# EAGLE design version_1 (EAGLE 6.1)
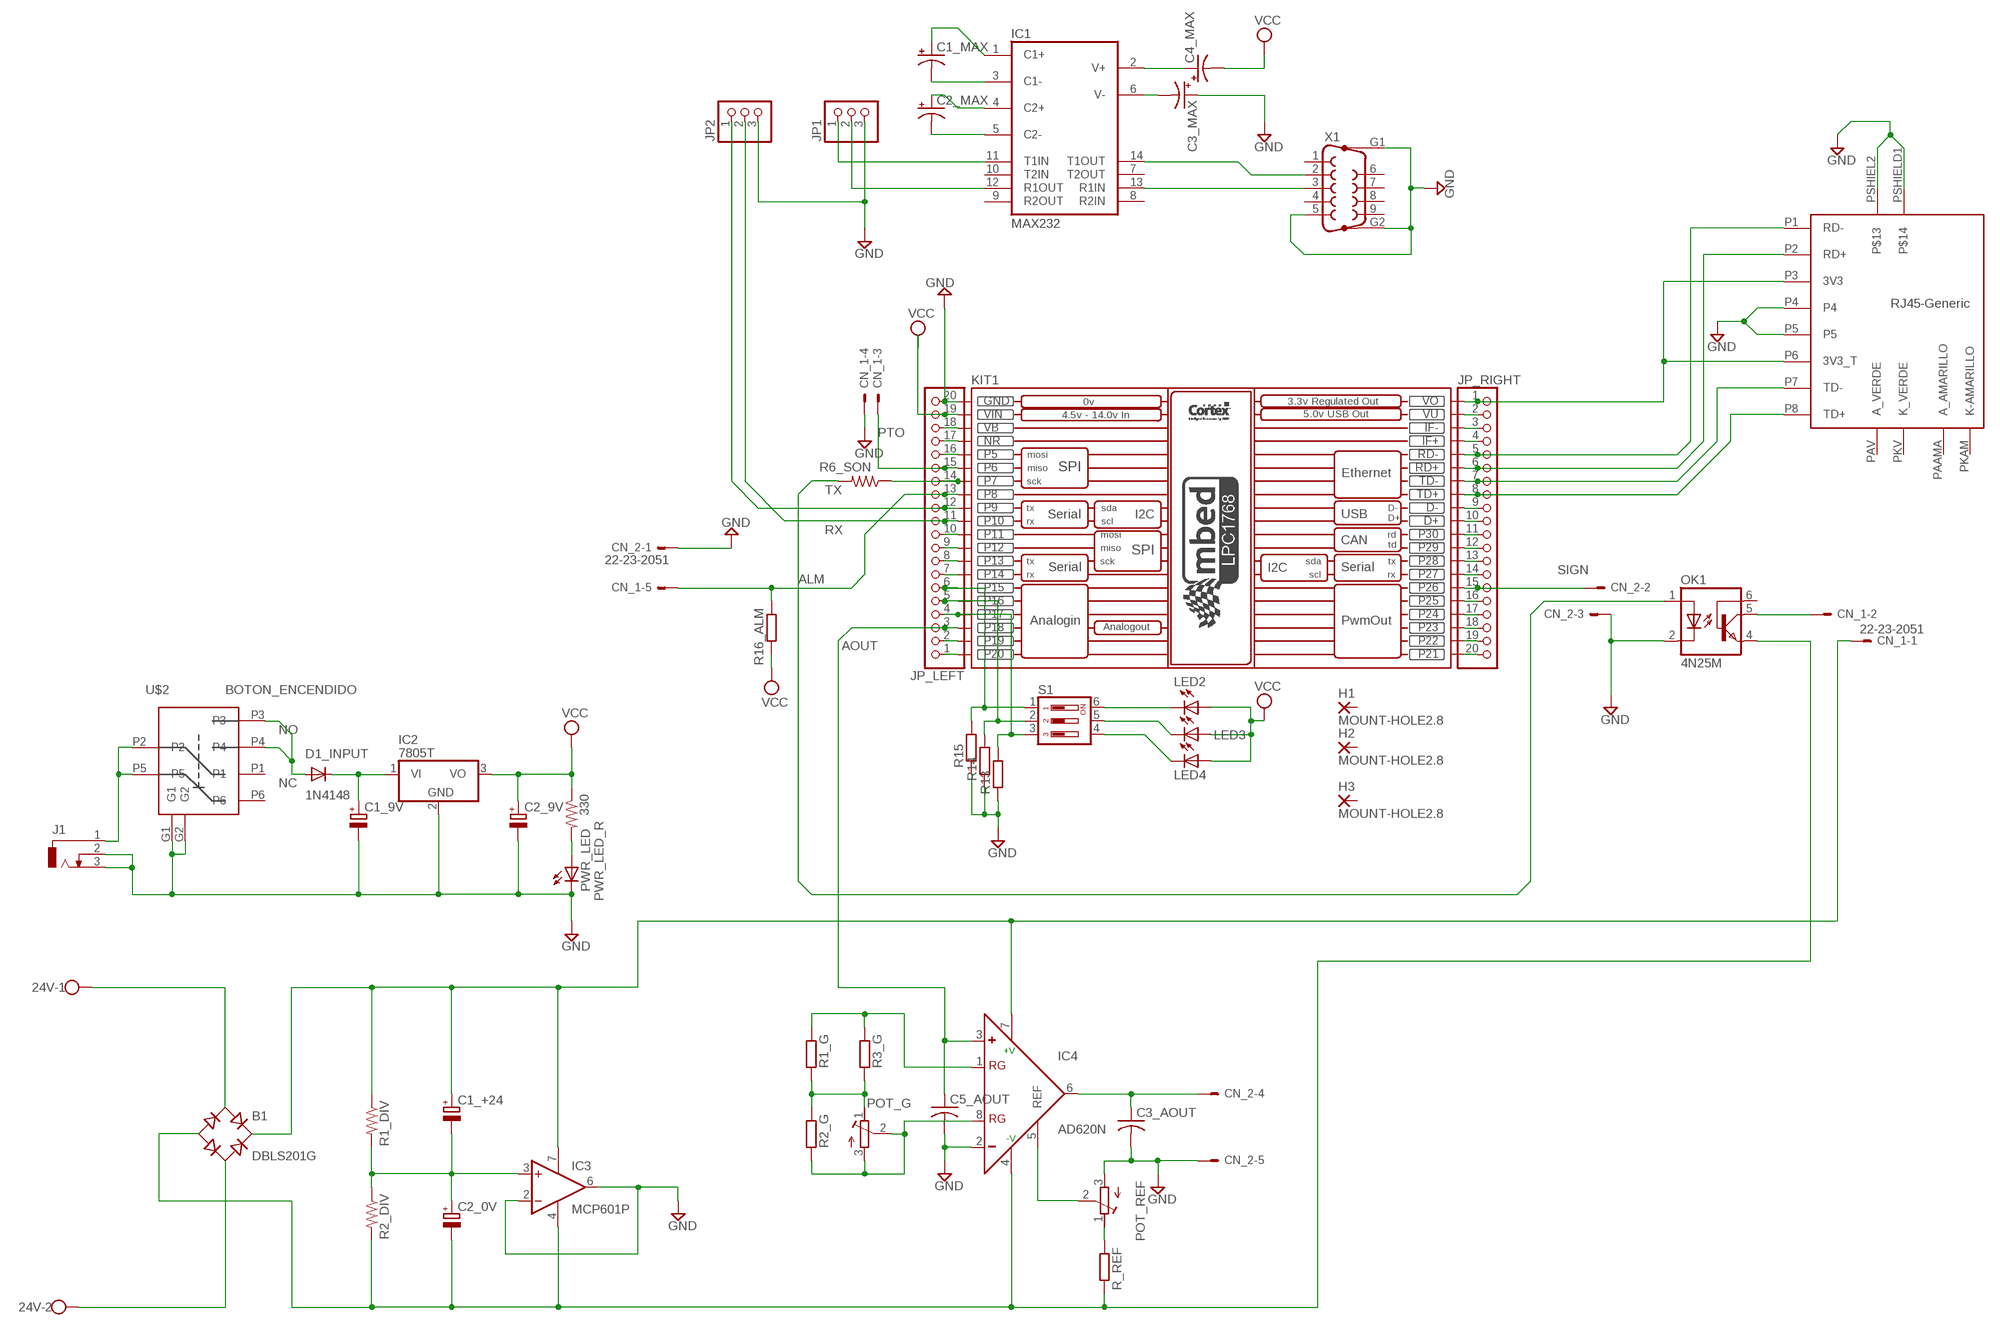
[diagram p0: schematic, sheet 1]

## Parts
24V  W237-02P  [W237-132]
B1  DBLS201G  [DBS]
C1_9V  CPOL-EUTT5D7  [TT5D7]
C1_+24  CPOL-EUTT5D7  [TT5D7]
C1_MAX  CPOL-USE2,5-6E  [E2,5-6E]
C2_0V  CPOL-EUTT5D7  [TT5D7]
C2_9V  CPOL-EUTT5D7  [TT5D7]
C2_MAX  CPOL-USE2,5-6E  [E2,5-6E]
C3_AOUT  C-US025-024X044  [C025-024X044]
C3_MAX  CPOL-USE2,5-6E  [E2,5-6E]
C4_MAX  CPOL-USE2,5-6E  [E2,5-6E]
C5_AOUT  C-US025-024X044  [C025-024X044]
CN_1  22-23-2051  [22-23-2051]
CN_2  22-23-2051  [22-23-2051]
D1_INPUT  1N4148  1N4148DO35-10  [DO35-10]
H1  MOUNT-HOLE2.8  2,54/0,8  [2,54/0,8]
H2  MOUNT-HOLE2.8  2,54/0,8  [2,54/0,8]
H3  MOUNT-HOLE2.8  2,54/0,8  [2,54/0,8]
IC1  MAX232  [DIL16]
IC2  7805T  [TO220H]
IC3  MCP601P  [DIL08]
IC4  AD620N  [DIL08]
J1  DCJ0303  [DCJ0303]
JP1  PINHD-1X3  [1X03]
JP2  PINHD-1X3  [1X03]
JP_LEFT  PINHD-1X20  [1X20]
JP_RIGHT  PINHD-1X20  [1X20]
KIT1  MBED_NXP_LPC1768  [MBED-KIT]
LED2  LED3MM  [LED3MM]
LED3  LED3MM  [LED3MM]
LED4  LED3MM  [LED3MM]
OK1  4N25M  [DIL06]
POT_G  R-TRIMMT93XB  [RTRIMT93XB]
POT_REF  R-TRIMMT93XB  [RTRIMT93XB]
PWR_LED  LED3MM  [LED3MM]
PWR_LED_R  330  R-US_0207/15  [0207/15]
R1_DIV  R-US_0207/10  [0207/10]
R1_G  R-EU_0207/2V  [0207/2V]
R2_DIV  R-US_0207/10  [0207/10]
R2_G  R-EU_0207/2V  [0207/2V]
R3_G  R-EU_0207/2V  [0207/2V]
R6_SON  R-US_0207/7  [0207/7]
R13  R-EU_0207/15  [0207/15]
R14  R-EU_0207/15  [0207/15]
R15  R-EU_0207/15  [0207/15]
R16_ALM  R-EU_0207/12  [0207/12]
R_REF  R-EU_0207/2V  [0207/2V]
S1  DIP03YL  [DIP03YL]
U$1  RJ-45-GENERIC  [RJ45-GENERIC]
U$2  BOTON_ENCENDIDO  [BOTON_ENCNEDIDO]
X1  F09HP  [F09HP]

## Nets
ALM: CN_1.5 JP_LEFT.13 KIT1.P$8(P8) R16_ALM.1
AOUT: C5_AOUT.1 IC4.3(+) JP_LEFT.3 KIT1.P$18(P18)
GND: C1_9V.- C2_9V.- C3_AOUT.2 C3_MAX.+ C5_AOUT.2 CN_1.4 CN_2.1 CN_2.3 CN_2.5 IC2.2(GND) IC3.2(-IN) IC3.6(OUT) IC4.2(-) J1.2 J1.3 JP1.3 JP2.3 JP_LEFT.20 KIT1.GND OK1.2(C) POT_REF.3(E) PWR_LED.K(C) R13.1 R14.1 R15.1 U$1.P4 U$1.P5 U$1.PSHIEL2 U$1.PSHIELD1 U$2.G1 U$2.G2 X1.5 X1.G1 X1.G2
N$1: B1.+ C1_+24.+ CN_1.1 IC3.7(V+) IC4.7(+V) R1_DIV.1
N$2: B1.- C2_0V.- IC3.4(V-) IC4.4(-V) OK1.4(EMI) R2_DIV.2 R_REF.2
N$3: C1_+24.- C2_0V.+ IC3.3(+IN) R1_DIV.2 R2_DIV.1
N$4: CN_1.2 OK1.5(COL)
N$5: JP_RIGHT.2 KIT1.VU
N$6: C3_AOUT.1 CN_2.4 IC4.6(OUT)
N$7: JP_RIGHT.3 KIT1.IF-
N$8: POT_REF.1(A) R_REF.1
N$9: IC4.1(RG) R1_G.1 R3_G.1
N$10: POT_G.1(A) R1_G.2 R2_G.1 R3_G.2
N$11: IC4.8(RG) POT_G.2(S) POT_G.3(E) R2_G.2
N$12: D1_INPUT.A U$2.P3 U$2.P4
N$13: JP_LEFT.5 KIT1.P$16(P16) R14.2 S1.2
N$14: JP_RIGHT.4 KIT1.IF+
N$15: IC4.5(REF) POT_REF.2(S)
N$16: JP_RIGHT.11 KIT1.P$30(P30)
N$17: OK1.1(A) R6_SON.2
N$18: J1.1 U$2.P2 U$2.P5
N$19: JP_LEFT.4 KIT1.P$17(P17) R13.2 S1.3
N$20: JP_RIGHT.1 KIT1.VOUT(VO) U$1.P3(3V3) U$1.P6(3V3_T)
N$21: C1_9V.+ D1_INPUT.C IC2.1(VI)
N$22: IC1.11(T1IN) JP1.1
N$23: IC1.12(R1OUT) JP1.2
N$24: LED2.K(C) S1.6
N$25: LED3.K(C) S1.5
N$26: LED4.K(C) S1.4
N$27: JP_RIGHT.5 KIT1.RD- U$1.P1(RD-)
N$28: JP_RIGHT.6 KIT1.RD+ U$1.P2(RD+)
N$29: JP_RIGHT.7 KIT1.TD- U$1.P7(TD-)
N$30: JP_RIGHT.8 KIT1.TD+ U$1.P8(TD+)
N$31: JP_RIGHT.9 KIT1.D-
N$32: JP_RIGHT.10 KIT1.D+
N$33: C1_MAX.+ IC1.1(C1+)
N$34: C1_MAX.- IC1.3(C1-)
N$35: C2_MAX.- IC1.5(C2-)
N$36: C2_MAX.+ IC1.4(C2+)
N$37: C4_MAX.+ IC1.2(V+)
N$38: C3_MAX.- IC1.6(V-)
N$39: JP_RIGHT.13 KIT1.P$28(P28)
N$40: IC1.14(T1OUT) X1.2
N$41: IC1.13(R1IN) X1.3
N$42: JP_RIGHT.18 KIT1.P$23(P23)
N$43: JP_RIGHT.19 KIT1.P$22(P22)
N$44: JP_RIGHT.14 KIT1.P$27(P27)
N$45: JP_RIGHT.16 KIT1.P$25(P25)
N$47: JP_RIGHT.17 KIT1.P$24(P24)
N$48: JP_LEFT.18 KIT1.VB
N$49: JP_LEFT.17 KIT1.NR
N$50: JP_LEFT.16 KIT1.P$5(P5)
N$51: JP_LEFT.14 KIT1.P$7(P7) R6_SON.1
N$53: JP_LEFT.10 KIT1.P$11(P11)
N$54: JP_LEFT.9 KIT1.P$12(P12)
N$55: JP_LEFT.8 KIT1.P$13(P13)
N$56: JP_LEFT.6 KIT1.P$15(P15) R15.2 S1.1
N$57: JP_LEFT.7 KIT1.P$14(P14)
N$59: JP_LEFT.2 KIT1.P$19(P19)
N$60: JP_LEFT.1 KIT1.P$20(P20)
N$61: PWR_LED.A PWR_LED_R.2
N$62: JP_RIGHT.20 KIT1.P$21(P21)
N$64: 24V.1 B1.AC1
N$65: 24V.2 B1.AC2
PTO: CN_1.3 JP_LEFT.15 KIT1.P$6(P6)
RX: JP2.2 JP_LEFT.11 KIT1.P$10(P10)
SIGN: CN_2.2 JP_RIGHT.15 KIT1.P$26(P26)
SIGN+: JP_RIGHT.12 KIT1.P$29(P29)
TX: JP2.1 JP_LEFT.12 KIT1.P$9(P9)
VCC: C2_9V.+ C4_MAX.- IC2.3(VO) JP_LEFT.19 KIT1.VIN LED2.A LED3.A LED4.A PWR_LED_R.1 R16_ALM.2
Unconnected: H1.1(P) H2.1(P) H3.1(P) IC1.7(T2OUT) IC1.8(R2IN) IC1.9(R2OUT) IC1.10(T2IN) OK1.6(BAS) U$1.PAAMA(A_AMARILLO) U$1.PAV(A_VERDE) U$1.PKAM(K-AMARILLO) U$1.PKV(K_VERDE) U$2.P1 U$2.P6 X1.1 X1.4 X1.6 X1.7 X1.8 X1.9

## Power pins joined to a net without a drawn wire
GND: IC1.15(GND)
VCC: IC1.16(VCC)

## Library data of the parts
24V = con-wago-508:W237-02P: WAGO SREW CLAMP
B1 = rectifier:DB?*G: Single Phase 1.0 AMP Glass Passivated Bridge Rectifier Taiwan Semiconductor Co.,Ltd. - TSC Source: http://www.taiwansemi.com/TSCbig5/ezcatfiles/cust/img/img/db101g.pdf http://www.ts.com.tw/db/pictures/modules/PDT/PDT060207001/DBLS201G.pdf
C1_9V C1_+24 C2_0V C2_9V = rcl:CPOL-EU: POLARIZED CAPACITOR, European symbol
C1_MAX C2_MAX C3_MAX C4_MAX = rcl:CPOL-US: POLARIZED CAPACITOR, American symbol
C3_AOUT C5_AOUT = rcl:C-US: CAPACITOR, American symbol
CN_1 CN_2 = con-molex:22-23-2051: .100" (2.54mm) Center Header - 5 Pin
D1_INPUT = diode:1N4148: DIODE high speed (Philips)
H1-H3 = wirepad:2,54/0,8: THROUGH-HOLE PAD
IC1 = maxim:MAX232: RS232 TRANSEIVER
IC2 = linear:78*: Positive VOLTAGE REGULATOR Source: http://cache.national.com/ds/LM/LM78L05.pdf http://www.fairchildsemi.com/ds/LM/LM7805.pdf
IC3 = linear:MCP601: Single Op Amp 2.7V to 6.0V Single Supply CMOS Source: http://ww1.microchip.com/downloads/en/DeviceDoc/21314g.pdf
IC4 = analog-devices:AD620: Low Cost, Low Power, Instrumentation Amplifier Source: http://www.analog.com/UploadedFiles/Data_Sheets/37793330023930AD620_e.pdf
J1 = con-jack:DCJ0303: DC POWER JACK Source: DCJ0303.pdf
JP1 JP2 = pinhead:PINHD-1X3: PIN HEADER
JP_LEFT JP_RIGHT = pinhead:PINHD-1X20: PIN HEADER
KIT1 = MBED_v2.1:MBED_NXP_LPC1768: Mbed LPC1768 - ARM CORTEX v2.1 * Schematic symbol is now placed in eagles's default raster. *The pads diameter are suitable for routing between mbed pins * mbed pads are 0.8 mm drill diameter. --------------------------------------------- Created by: Mohamed Yousry *Alexandria, Egypt *Email: mohamed.yousry@ieeegoldegypt.org
LED2-LED4 PWR_LED = led:LED: LED OSRAM: - CHIPLED LG R971, LG N971, LY N971, LG Q971, LY Q971, LO R971, LY R971 LH N974, LH R974 LS Q976, LO Q976, LY Q976 LO Q996 - Hyper CHIPLED LW Q18S LB Q993, LB Q99A, LB R99A - SideLED LS A670, LO A670, LY A670, LG A670, LP A670 LB A673, LV A673, LT A673, LW A673 LH A674 LY A675 LS A676, LA A676, LO A676, LY A676, LW A676 LS A679, LY A679, LG A679 - Hyper Micro SIDELED® LS Y876, LA Y876, LO Y876, LY Y876 LT Y87S - SmartLED LW L88C, LW L88S LB L89C, LB L89S, LG L890 LS L89K, LO L89K, LY L89K LS L896, LA L896, LO L896, LY L896 - TOPLED LS T670, LO T670, LY T670, LG T670, LP T670 LSG T670, LSP T670, LSY T670, LOP T670, LYG T670 LG T671, LOG T671, LSG T671 LB T673, LV T673, LT T673, LW T673 LH T674 LS T676, LA T676, LO T676, LY T676, LB T676, LH T676, LSB T676, LW T676 LB T67C, LV T67C, LT T67C, LS T67K, LO T67K, LY T67K, LW E67C LS E67B, LA E67B, LO E67B, LY E67B, LB E67C, LV E67C, LT E67C LW T67C LS T679, LY T679, LG T679 LS T770, LO T770, LY T770, LG T770, LP T770 LB T773, LV T773, LT T773, LW T773 LH T774 LS E675, LA E675, LY E675, LS T675 LS T776, LA T776, LO T776, LY T776, LB T776 LHGB T686 LT T68C, LB T68C - Hyper Mini TOPLED® LB M676 - Mini TOPLED Santana® LG M470 LS M47K, LO M47K, LY M47K Source: http://www.osram.convergy.de LUXEON: - LUMILED® LXK2-PW12-R00, LXK2-PW12-S00, LXK2-PW14-U00, LXK2-PW14-V00 LXK2-PM12-R00, LXK2-PM12-S00, LXK2-PM14-U00 LXK2-PE12-Q00, LXK2-PE12-R00, LXK2-PE12-S00, LXK2-PE14-T00, LXK2-PE14-U00 LXK2-PB12-K00, LXK2-PB12-L00, LXK2-PB12-M00, LXK2-PB14-N00, LXK2-PB14-P00, LXK2-PB14-Q00 LXK2-PR12-L00, LXK2-PR12-M00, LXK2-PR14-Q00, LXK2-PR14-R00 LXK2-PD12-Q00, LXK2-PD12-R00, LXK2-PD12-S00 LXK2-PH12-R00, LXK2-PH12-S00 LXK2-PL12-P00, LXK2-PL12-Q00, LXK2-PL12-R00 Source: www.luxeon.com KINGBRIGHT: KA-3528ASYC Source: www.kingbright.com
OK1 = optocoupler:4N*?M: General Purpose 6-Pin Phototransistor Optocouplers Source: http://www.fairchildsemi.com/ds/4N/4N35-M.pdf
POT_G POT_REF = rcl:R-TRIMM: Trimm resistor
PWR_LED_R R6_SON = rcl:R-US_: RESISTOR, American symbol
R1_DIV R2_DIV = resistor:R-US_: RESISTOR, American symbol
R1_G R2_G R3_G R13-R15 R16_ALM R_REF = rcl:R-EU_: RESISTOR, European symbol
S1 = switch-dil:DIP03YL: DIL/CODE SWITCH
U$1 = RJ45:RJ-45-GENERIC
U$2 = Boton_Encendido:BOTON_ENCENDIDO
X1 = con-subd:F09HP: SUB-D

## Board
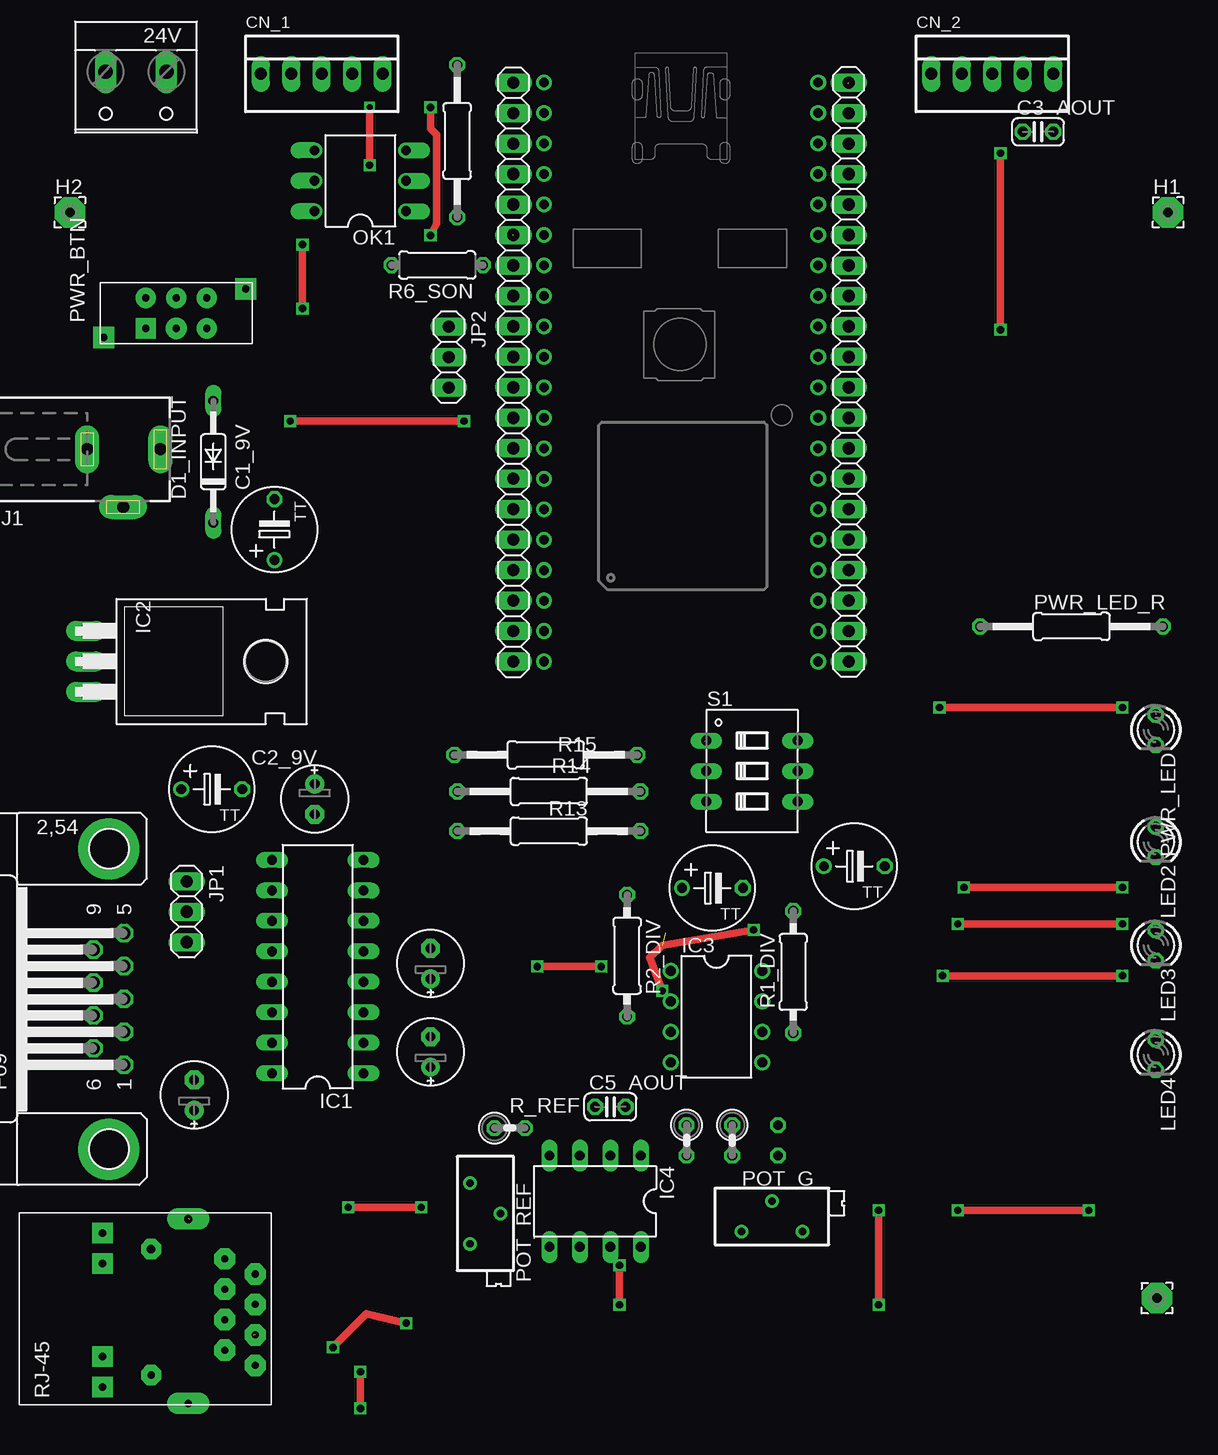
[diagram p1: board, top side]
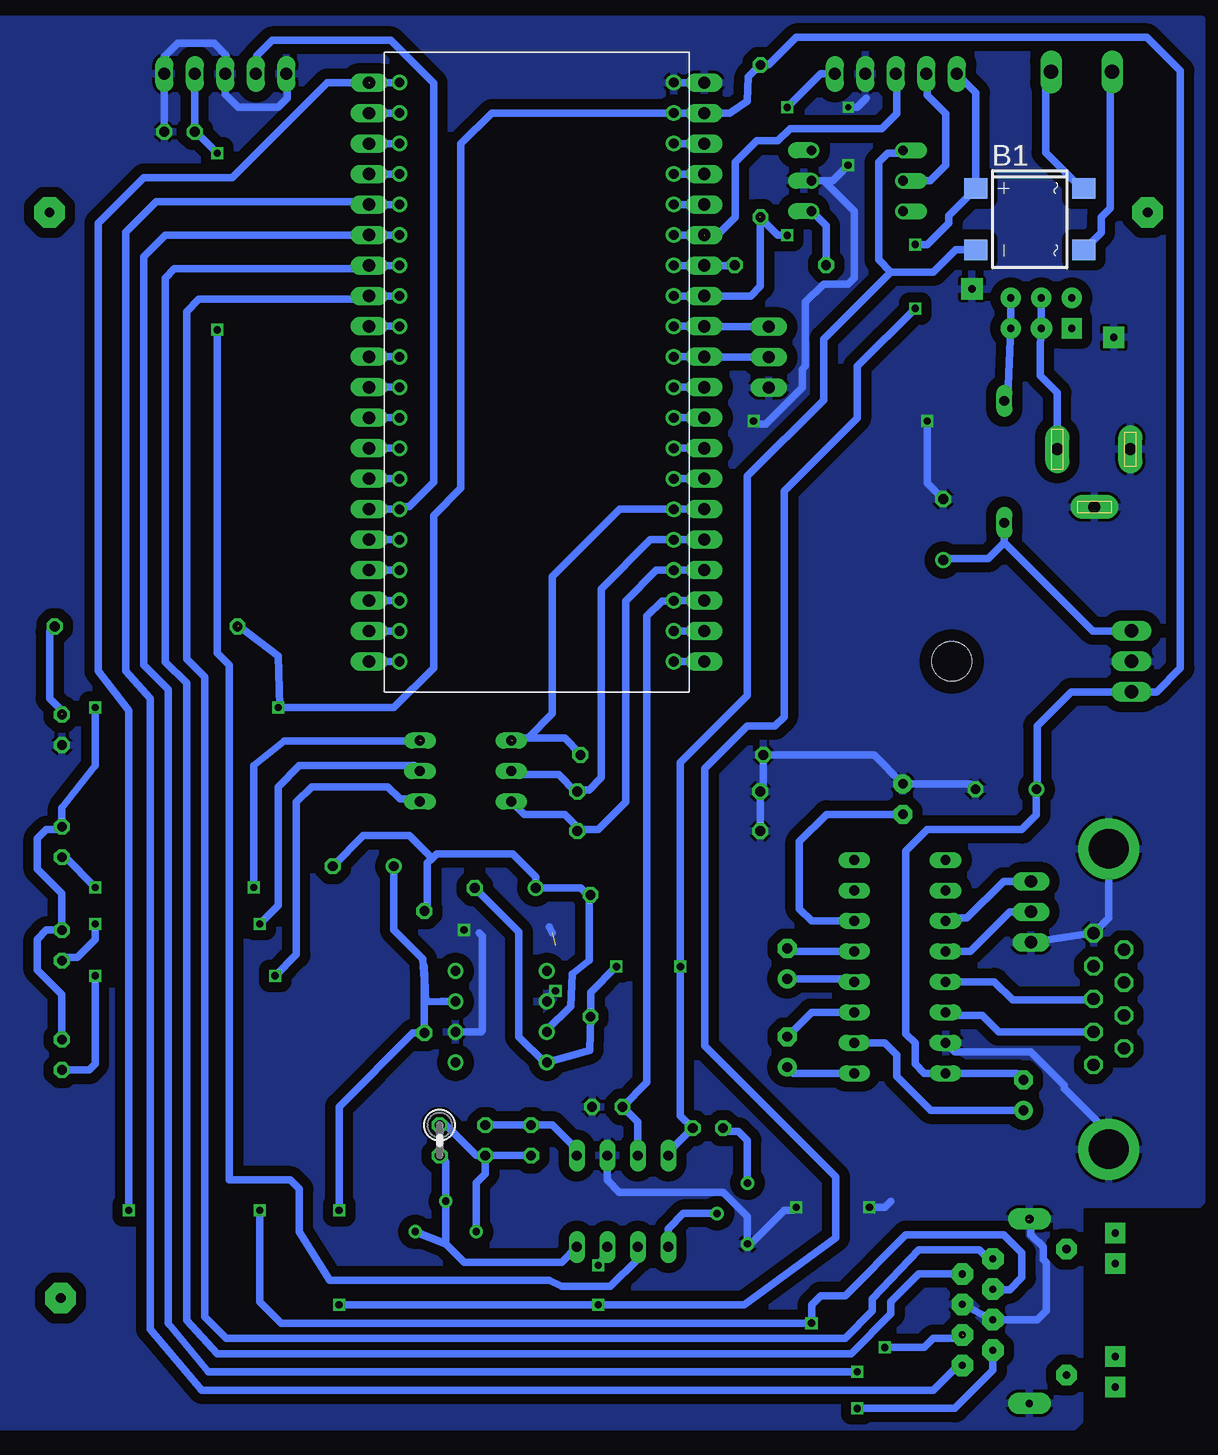
[diagram p2: board, bottom side, seen from below]

No outline drawn. Coordinates in mm, seen from the top.
Copper layers (1*16): Top 0.035mm / dielectric 1.5mm / Bottom 0.035mm
Design rules: minimum track width 10mil, minimum drill 24mil, track to track 34mil, track to pad 34mil, pad to pad 34mil, via to via 34mil, smd to smd 34mil, copper to edge 40mil, drill to drill 8mil, minimum pad ring 10mil, minimum via ring 8mil, stop-mask expansion 4mil, vias tented up to drill 0mil, thermal gap 10mil

### Footprints (pad centres in the part's own frame; a part is rotated, then mirrored left to right if it is on the bottom)
W237-132 = drill 1.194 long: 1 -2.54,-0.635; 2 2.54,-0.635
DBS = smd 1.7 x 1.9: + -2.55,-4.5; - 2.55,-4.5; AC1 -2.55,4.5; AC2 2.55,4.5
TT5D7 = drill 0.813: + -2.54,0 | drill 0.813 octagon: - 2.54,0
E2,5-6E = drill 0.813 pad 1.575: + -1.27,0 | drill 0.813 pad 1.575 octagon: - 1.27,0
C025-024X044 = drill 0.813 octagon: 1 -1.27,0; 2 1.27,0
22-23-2051 = drill 1 long: 1 -5.08,0; 2 -2.54,0; 3 0,0; 4 2.54,0; 5 5.08,0
DO35-10 = drill 0.813 long: A 5.08,0; C -5.08,0
2,54/0,8 = drill 0.813 pad 2.54 octagon: 1 0,0
DIL16 = drill 0.813 long: 1 -8.89,-3.81; 2 -6.35,-3.81; 3 -3.81,-3.81; 4 -1.27,-3.81; 5 1.27,-3.81; 6 3.81,-3.81; 7 6.35,-3.81; 8 8.89,-3.81; 9 8.89,3.81; 10 6.35,3.81; 11 3.81,3.81; 12 1.27,3.81; 13 -1.27,3.81; 14 -3.81,3.81; 15 -6.35,3.81; 16 -8.89,3.81
TO220H = drill 1.118 long: 1 -2.54,-10.16; 2 0,-10.16; 3 2.54,-10.16 | hole 3.302: 0,4.826
DIL08 = drill 0.813 pad 1.27: 1 -3.81,-3.81; 2 -1.27,-3.81; 3 1.27,-3.81; 4 3.81,-3.81; 5 3.81,3.81; 6 1.27,3.81; 7 -1.27,3.81; 8 -3.81,3.81
DIL08' = drill 0.813 long: 1 -3.81,-3.81; 2 -1.27,-3.81; 3 1.27,-3.81; 4 3.81,-3.81; 5 3.81,3.81; 6 1.27,3.81; 7 -1.27,3.81; 8 -3.81,3.81
DCJ0303 = drill 1 pad 2 long: 1 0,3.1; 2 4.8,0; 3 0,-3
1X03 = drill 1.016 long: 1 -2.54,0; 2 0,0; 3 2.54,0
1X20 = drill 1.016 long: 1 -24.13,0; 2 -21.59,0; 3 -19.05,0; 4 -16.51,0; 5 -13.97,0; 6 -11.43,0; 7 -8.89,0; 8 -6.35,0; 9 -3.81,0; 10 -1.27,0; 11 1.27,0; 12 3.81,0; 13 6.35,0; 14 8.89,0; 15 11.43,0; 16 13.97,0; 17 16.51,0; 18 19.05,0; 19 21.59,0; 20 24.13,0
MBED-KIT = drill 0.8: D+ 11.43,1.27; D- 11.43,3.81; GND -11.43,24.13; IF+ 11.43,16.51; IF- 11.43,19.05; NR -11.43,16.51; P$5 -11.43,13.97; P$6 -11.43,11.43; P$7 -11.43,8.89; P$8 -11.43,6.35; P$9 -11.43,3.81; P$10 -11.43,1.27; P$11 -11.43,-1.27; P$12 -11.43,-3.81; P$13 -11.43,-6.35; P$14 -11.43,-8.89; P$15 -11.43,-11.43; P$16 -11.43,-13.97; P$17 -11.43,-16.51; P$18 -11.43,-19.05; P$19 -11.43,-21.59; P$20 -11.43,-24.13; P$21 11.43,-24.13; P$22 11.43,-21.59; P$23 11.43,-19.05; P$24 11.43,-16.51; P$25 11.43,-13.97; P$26 11.43,-11.43; P$27 11.43,-8.89; P$28 11.43,-6.35; P$29 11.43,-3.81; P$30 11.43,-1.27; RD+ 11.43,11.43; RD- 11.43,13.97; TD+ 11.43,6.35; TD- 11.43,8.89; VB -11.43,19.05; VIN -11.43,21.59; VOUT 11.43,24.13; VU 11.43,21.59
LED3MM = drill 0.813 octagon: A -1.27,0; K 1.27,0
DIL06 = drill 0.813 offset: 1 -2.54,-3.81; 2 0,-3.81; 3 2.54,-3.81; 4 2.54,3.81; 5 0,3.81; 6 -2.54,3.81
RTRIMT93XB = drill 0.61: 1 1.27,-2.54; 2 -1.27,0; 3 1.27,2.54
0207/15 = drill 0.813 octagon: 1 -7.62,0; 2 7.62,0
0207/10 = drill 0.813 octagon: 1 -5.08,0; 2 5.08,0
0207/2V = drill 0.813 octagon: 1 -1.27,0; 2 1.27,0
0207/7 = drill 0.813 octagon: 1 -3.81,0; 2 3.81,0
0207/12 = drill 0.813 octagon: 1 -6.35,0; 2 6.35,0
DIP03YL = drill 0.813 long: 1 -2.54,-3.81; 2 0,-3.81; 3 2.54,-3.81; 4 2.54,3.81; 5 0,3.81; 6 -2.54,3.81
RJ45-GENERIC = drill 0.6 pad 1.778 octagon: P1 12.2,19.685; P2 10.93,17.145; P3 9.66,19.685; P4 8.39,17.145; P5 7.12,19.685; P6 5.85,17.145; P7 4.58,19.685; P8 3.31,17.145 | drill 0.6 pad 1.676 square: PAAMA 1.17,6.958; PAV 11.465,6.958; PKAM 3.71,6.958; PKV 14.005,6.958 | drill 0.6 pad 1.778 long: PSHIEL2 15.375,14.105 | drill 0.7 pad 1.778 long: PSHIELD1 0,14.105 | drill 0.7 pad 1.676 octagon: PSTAND 2.5,11.008 | drill 0.6 pad 1.676 octagon: PSTAND2 13,11.008
BOTON_ENCNEDIDO = drill 0.6 pad 1.778 square: G1 -2.019,6.039; G2 2.018,-5.785 | drill 0.6 pad 1.676 square: P1 -1.27,2.54 | drill 0.6 pad 1.778: P2 -1.27,0 | drill 0.6 pad 1.676: P3 -1.27,-2.54; P4 1.27,-2.54; P5 1.27,0; P6 1.27,2.54
F09HP = drill 1.016 octagon: 1 -5.486,-1.27; 2 -2.743,-1.27; 3 0,-1.27; 4 2.743,-1.27; 5 5.486,-1.27; 6 -4.115,1.27; 7 -1.372,1.27; 8 1.372,1.27; 9 4.115,1.27 | drill 3.302 pad 5.08: G1 -12.522,0; G2 12.522,0

### Placement (x,y rotation side)
24V  10,115.11 180 top
B1  14.32,103.46 270 bottom
C1_9V  21.54,77.58 90 top
C1_+24  69.87,49.51 0 top
C1_MAX  34.54,34.04 90 top
C2_0V  58.04,47.7 0 top
C2_9V  16.31,55.94 0 top
C2_MAX  34.54,41.4 90 top
C3_AOUT  85.17,110.74 0 top
C3_MAX  24.89,55.12 270 top
C4_MAX  14.84,30.44 90 top
C5_AOUT  49.53,29.46 0 top
CN_1  25.48,115.57 0 top
CN_2  81.36,115.57 0 top
D1_INPUT  16.45,83.23 90 top
H1  96.01,104.02 0 top
H2  4.5,104.02 0 top
H3  95.08,13.51 0 top
IC1  25.15,41.15 90 top
IC2  15.99,66.6 270 top
IC3  58.37,36.97 270 top
IC4  AD620N  [DIL08']  48.26,21.59 180 top
J1  8.93,84.27 270 top
JP1  14.22,45.72 270 top
JP2  36.07,91.95 270 top
JP_LEFT  41.45,90.71 90 top
JP_RIGHT  69.39,90.71 270 top
KIT1  55.42,90.71 0 top
LED2  94.98,51.54 270 top
LED3  94.98,42.92 270 top
LED4  94.98,33.8 270 top
OK1  28.69,106.66 90 top
POT_G  62.99,20.32 270 top
POT_REF  39.12,20.57 180 top
PWR_LED  94.98,60.89 270 top
PWR_LED_R  87.96,69.5 0 top
R1_DIV  64.77,40.7 90 top
R1_G  59.69,26.67 270 top
R2_DIV  50.93,42.05 270 top
R2_G  63.5,26.67 270 bottom
R3_G  55.88,26.67 270 top
R6_SON  35.11,99.63 180 top
R13  44.4,52.45 0 top
R14  44.4,55.75 0 top
R15  44.15,58.8 0 top
R16_ALM  36.77,109.97 90 top
R_REF  41.15,27.69 0 top
S1  61.34,57.45 270 top
U$1  0.25,20.11 270 top
U$2  13.36,95.62 90 top
X1  7.74,38.45 90 top

### Tracks (layer width: path | path; a pad name or v marks a point on that pad's centre or on a via)
ALM  (via drill 0.6)  (1 unrouted)
  Top 0.61: v34.54,112.78 34.54,111 35.05,110.49 35.05,103.12 v34.54,102.11
  Bottom 0.61: CN_1.5 31.75,115.57 v34.54,112.78 | R16_ALM.1 36.77,97.85 37.59,97.03 41.42,97.03 JP_LEFT.13 KIT1.P$8 | v34.54,102.11 35.31,102.11 36.83,103.63
AOUT
  Bottom 0.61: JP_LEFT.3 KIT1.P$18 44.02,71.63 44.96,71.63 46.23,70.36 46.23,31.5 C5_AOUT.1 46.99,28.19 IC4.3
GND  (via drill 0.5 pad 0.81, 0.6)  (2 unrouted)
  Top 0.61: v53.85,39.12 52.83,41.91 53.85,42.93 v61.47,44.2 | v33.78,21.08 v27.69,21.08 | v29.46,107.95 v29.46,112.78 | v37.34,86.61 v22.86,86.61
  Bottom 0.61: C3_AOUT.2 CN_2.5 86.44,117.01 85.34,118.11 82.3,118.11 81.28,117.09 81.28,115.57 | 81.28,115.57 81.28,115.32 81.53,115.57 CN_2.3 | CN_2.3 81.28,115.57 | CN_2.3 81.36,113.87 80.26,112.78 76.96,112.78 76.2,113.54 76.2,115.49 CN_2.1 | U$1.P5 U$1.P4 13.68,11.72 12.95,12.45 12.95,16.51 13.21,16.76 13.21,17.78 14.22,18.8 14.22,19.81 14.48,20.07 14.22,20.07 | R13.1 R14.1 36.53,56 R15.1 27.3,58.8 C3_MAX.+ 19.3,56.39 C2_9V.- | X1.G1 7.74,27.3 11.43,30.99 11.43,31.24 14.22,34.04 20.57,34.04 IC1.15 | JP1.3 X1.5 7.74,45.21 X1.G2 | IC4.2 49.53,23.37 48.51,22.35 39.88,22.35 37.85,20.32 POT_REF.3 37.59,18.03 34.8,20.83 34.04,20.83 v33.78,21.08 | JP_LEFT.20 KIT1.GND | IC3.2 54.56,38.4 v53.85,39.12 | 54.1,43.94 54.36,44.45 | v27.69,21.08 26.42,21.08 25.91,21.59 | v29.46,107.95 30.76,106.66 OK1.2 31.47,106.66 28.96,104.14 28.96,98.55 29.46,98.04 31.5,98.04 33.02,96.52 33.02,91.19 33.27,90.93 33.27,89.41 36.32,86.36 37.08,86.36 v37.34,86.61 | v29.46,112.78 28.7,112.78 27.94,113.54 | v22.86,86.61 22.86,81.44 C1_9V.- | IC3.6 60.05,35.7 59.94,35.81 59.94,43.69 60.2,43.94
  pour Bottom: 0,21.84 0,120.14 100.08,120.14 100.33,119.89 100.33,3.05 100.08,2.79 10.67,2.79 10.16,3.3 10.16,21.08 9.91,21.34 0.25,21.34 0,21.59
N$1  (via drill 0.6)
  Top 0.61: v23.88,101.35 v23.88,96.01 | v71.88,12.95 v71.88,20.83 | v50.29,16.26 v50.29,12.95
  Bottom 0.61: CN_1.1 18.82,113.99 B1.+ 21.08,103.75 21.08,103.12 22.86,101.35 v23.88,101.35 | v23.88,96.01 28.7,91.19 28.7,86.87 34.8,80.77 34.8,61.98 35.56,61.21 37.85,61.21 41.4,57.66 41.4,34.54 30.48,23.62 30.48,18.54 38.1,12.95 v50.29,12.95 v71.88,12.95 | 64.64,38.23 64.77,41.15 R1_DIV.1 65.72,35.62 71.88,29.46 v71.88,20.83 | 64.64,38.23 63.36,38.24 IC3.7 | C1_+24.+ 67.31,49.5 67.31,44.2 64.9,41.78 64.64,38.23 | IC4.7 49.53,17.27 v50.29,16.26
N$2  (via drill 0.6)
  Top 0.61: v43.43,41.15 v48.77,41.15
  Bottom 0.61: B1.- 20.51,100.91 22.35,99.06 25.91,99.06 | 25.91,99.06 26.92,100.08 26.92,108.2 26.16,108.97 25.11,108.97 OK1.4 | 25.91,99.06 31.5,93.47 31.5,88.39 37.85,82.04 37.85,63.75 43.43,58.17 v43.43,41.15 43.43,28.7 R_REF.2 44.45,25.65 IC4.4 | v48.77,41.15 50.93,38.99 R2_DIV.2 51.01,34.18 IC3.4 54.75,33.16 56.9,35.31 56.9,44.02 C2_0V.-
N$3
  Bottom 0.61: IC3.3 54.56,35.86 52.58,37.85 52.43,40.53 51.05,41.66 51.05,47.01 | 51.05,47.01 R2_DIV.1 | 51.05,47.01 51.75,47.7 C2_0V.+ 55.5,48.64 57.4,50.55 63.75,50.55 64.14,50.16 | 64.14,50.16 64.52,49.78 64.52,46.04 R1_DIV.2 | C1_+24.- 69.85,52.07 66.04,52.07 64.14,50.16
N$4
  Bottom 0.61: OK1.5 22.63,106.66 21.34,107.95 21.34,112.27 22.86,113.79 22.86,115.49 CN_1.2
N$5
  Bottom 0.61: KIT1.VU JP_RIGHT.2
N$6  (via drill 0.6)
  Top 0.61: v82.04,108.97 v82.04,94.23
  Bottom 0.61: CN_2.4 C3_AOUT.1 83.82,110.74 v82.04,108.97 | v82.04,94.23 82.04,67.31 81.03,66.29 81.03,23.37 75.95,23.37 75.18,22.61 75.18,19.05 72.64,14.99 54.36,14.99 53.34,14.48 49.28,14.48 46.99,16.76 IC4.6
N$7
  Bottom 0.61: KIT1.IF- JP_RIGHT.3
N$8
  Bottom 0.61: POT_REF.1 37.85,26.67 38.61,27.43 39.62,27.43 R_REF.1
N$9
  Bottom 0.61: R1_G.1 R3_G.1 54.1,27.94 52.32,26.16 52.32,25.65 IC4.1
N$10
  Bottom 0.61: POT_G.1 60.45,23.11 59.69,23.88 R1_G.2 R3_G.2 60.45,25.4 62.99,27.94 R2_G.1
N$11
  Bottom 0.61: IC4.8 53.34,16.51 61.47,16.51 62.99,18.03 | 62.99,18.03 POT_G.2 62.99,24.89 R2_G.2 | POT_G.3 62.99,18.03
N$12
  Bottom 0.61: U$2.P4 U$2.P3 16.15,88.61 D1_INPUT.A
N$13
  Bottom 0.61: S1.2 57.23,57.15 53.59,57.15 52.19,55.75 R14.2 51.89,55.88 51.05,55.88 50.04,56.9 50.04,72.64 45.94,76.74 KIT1.P$16 JP_LEFT.5
N$14
  Bottom 0.61: KIT1.IF+ JP_RIGHT.4
N$15
  Bottom 0.61: POT_REF.2 43.18,20.57 44.45,19.3 IC4.5
N$16
  Bottom 0.61: KIT1.P$30 JP_RIGHT.11
N$17
  Bottom 0.61: R6_SON.2 31.3,102.91 OK1.1
N$18
  Bottom 0.61: J1.1 12.03,88.99 13.46,90.42 13.46,92.93 U$2.P2 U$2.P5
N$19
  Bottom 0.61: S1.3 56.47,53.85 53.09,53.85 52.02,52.79 R13.2 51.89,52.58 50.29,52.58 48.01,54.86 48.01,71.63 45.43,74.2 KIT1.P$17 JP_LEFT.4
N$20  (via drill 0.6)  (2 unrouted)
  Top 0.61: v89.41,20.83 v78.49,20.83 | v32.51,11.43 29.21,12.19 v26.42,9.4
  Bottom 0.61: 69.34,114.81 69.31,114.84 KIT1.VOUT 72.87,114.84 80.77,106.93 88.14,106.93 91.95,103.12 91.95,65.79 89.41,62.48 v89.41,20.83 | v78.49,20.83 78.49,13.21 76.71,11.43 v32.51,11.43 32.51,12.95 31.75,13.72 29.72,13.72 24.64,18.8 16.51,18.8 14.99,17.27 14.99,15.24 16,14.22 17.37,14.22 U$1.P6 | v26.42,9.4 23.11,9.4 22.35,10.16 20.32,10.16 19.81,10.67 19.81,10.41
N$21
  Bottom 0.61: D1_INPUT.C 16.45,76.52 | 16.45,76.52 17.78,75.18 21.39,75.18 C1_9V.+ | IC2.1 9.06,69.14 16.45,76.52
N$22
  Bottom 0.61: JP1.1 16.51,48.26 19.56,45.21 21.08,45.21 IC1.11
N$23
  Bottom 0.61: IC1.12 19.3,42.42 16,45.72 JP1.2
N$24  (via drill 0.6)  (1 unrouted)
  Top 0.61: v92.2,47.75 v78.99,47.75
  Bottom 0.61: LED2.K 94.72,50.27 v92.2,47.75 | v78.99,47.75 78.99,57.91 76.45,59.94 65.02,59.94
N$25  (via drill 0.6)
  Top 0.61: v92.2,44.7 v78.49,44.7
  Bottom 0.61: LED3.K 94.98,41.93 93.71,41.93 92.2,43.43 v92.2,44.7 | v78.49,44.7 76.96,46.23 76.96,56.13 75.18,57.91 65.61,57.91 S1.5
N$26  (via drill 0.6)
  Top 0.61: v92.2,40.39 v77.22,40.39
  Bottom 0.61: LED4.K 92.69,32.53 92.2,33.02 v92.2,40.39 | v77.22,40.39 75.44,42.16 75.44,54.86 74.17,56.13 67.82,56.13 66.8,55.12 65.36,55.12 S1.4
N$27
  Bottom 0.61: U$1.P1 20.29,7.91 22.35,5.84 83.31,5.84 87.63,10.92 87.63,63.5 89.66,65.79 89.66,102.36 87.12,104.9 69.61,104.9 JP_RIGHT.5 KIT1.RD-
N$28  (via drill 0.6)
  Top 0.61: v28.7,4.32 v28.7,7.37
  Bottom 0.61: U$1.P2 17.4,7.49 20.57,4.32 v28.7,4.32 | v28.7,7.37 82.8,7.37 86.11,11.43 86.11,64.26 88.14,66.29 88.14,100.33 86.36,102.11 69.42,102.11 JP_RIGHT.6 KIT1.RD+
N$29
  Bottom 0.61: U$1.P7 23.59,15.53 25.91,13.21 25.91,12.19 29.21,8.89 82.04,8.89 84.58,11.68 84.58,64.77 86.36,66.55 86.36,98.55 85.6,99.31 69.68,99.31 JP_RIGHT.7 KIT1.TD-
N$30
  Bottom 0.61: U$1.P8 17.81,16.8 18.54,17.53 23.59,17.56 27.43,13.46 27.43,12.45 29.72,10.16 81.28,10.16 83.06,11.94 83.06,65.28 84.58,66.8 84.58,95.76 83.57,96.77 69.68,96.77 JP_RIGHT.8 KIT1.TD+
N$31
  Bottom 0.61: KIT1.D- JP_RIGHT.9
N$32
  Bottom 0.61: KIT1.D+ JP_RIGHT.10
N$33
  Bottom 0.61: C1_MAX.+ 34.04,32.26 IC1.1
N$34
  Bottom 0.61: C1_MAX.- 32.51,37.34 IC1.3
N$35
  Bottom 0.61: C2_MAX.- 34.29,42.42 IC1.5
N$36
  Bottom 0.61: IC1.4 29.21,40.13 C2_MAX.+
N$37
  Bottom 0.61: C4_MAX.+ 22.57,29.17 25.4,32 25.4,33.78 26.42,34.8 IC1.2
N$38
  Bottom 0.61: IC1.6 32.51,44.96 33.53,45.97 33.53,51.56 31.24,53.85 C3_MAX.-
N$39
  Bottom 0.61: KIT1.P$28 JP_RIGHT.13
N$40
  Bottom 0.61: X1.2 16.91,35.71 18.29,37.08 21.08,37.08 IC1.14
N$41
  Bottom 0.61: IC1.13 17.27,39.88 15.75,38.35 9.11,38.35 X1.3
N$42
  Bottom 0.61: KIT1.P$23 JP_RIGHT.18
N$43
  Bottom 0.61: KIT1.P$22 JP_RIGHT.19
N$44
  Bottom 0.61: KIT1.P$27 JP_RIGHT.14
N$45
  Bottom 0.61: KIT1.P$25 JP_RIGHT.16
N$47
  Bottom 0.61: KIT1.P$24 JP_RIGHT.17
N$48
  Bottom 0.61: JP_LEFT.18 KIT1.VB
N$49
  Bottom 0.61: JP_LEFT.17 KIT1.NR
N$50
  Bottom 0.61: JP_LEFT.16 KIT1.P$5
N$51
  Bottom 0.61: KIT1.P$7 JP_LEFT.14 38.95,99.6 R6_SON.1
N$53
  Bottom 0.61: JP_LEFT.10 KIT1.P$11
N$54
  Bottom 0.61: JP_LEFT.9 KIT1.P$12
N$55
  Bottom 0.61: JP_LEFT.8 KIT1.P$13
N$56  (1 unrouted)
  Bottom 0.61: R15.2 51.77,58.88 53.09,60.2 56.13,60.2 | 56.13,60.2 57.15,60.2 57.4,59.94 | JP_LEFT.6 KIT1.P$15 48.48,79.28 54.1,73.66 54.1,62.23 56.13,60.2
N$57
  Bottom 0.61: JP_LEFT.7 KIT1.P$14
N$59
  Bottom 0.61: JP_LEFT.2 KIT1.P$19
N$60
  Bottom 0.61: JP_LEFT.1 KIT1.P$20
N$61  (1 unrouted)
  Bottom 0.61: PWR_LED_R.2 96.01,69.07 96.01,63.5 95,62.48 95,62.23
N$62
  Bottom 0.61: KIT1.P$21 JP_RIGHT.20
N$64
  Bottom 0.61: 24V.1 13,115.28 13,109 9.92,105.92 9.91,105.92 B1.AC1
N$65
  Bottom 0.61: B1.AC2 8.38,102.35 8.38,103.63 7.62,104.39 7.62,115.06 7.46,115.22 24V.2
PTO  (1 unrouted)
  Bottom 0.61: KIT1.P$6 41.69,102.14 41.66,102.11 41.4,102.11 | JP_LEFT.15 40.35,102.14 38.86,103.63 38.86,108.2 37.08,109.98 35.31,109.98 34.29,111 26.67,111 25.4,112.27 25.4,115.49 CN_1.3
RX
  Bottom 0.61: JP2.2 41.42,91.95 JP_LEFT.11 KIT1.P$10
SIGN
  Bottom 0.61: KIT1.P$26 JP_RIGHT.15 67.02,79.28 66.8,79.5 66.04,79.5 64.01,81.53 64.01,114.81 67.56,118.36 77.47,118.36 78.74,117.09 78.74,115.65 CN_2.2
SIGN+
  Bottom 0.61: KIT1.P$29 JP_RIGHT.12
TX
  Bottom 0.61: KIT1.P$9 JP_LEFT.12 41.42,94.49 JP2.1
VCC  (via drill 0.6)  (1 unrouted)
  Top 0.61: v92.2,62.74 v76.96,62.74
  Bottom 0.61: LED4.A 94.98,38.85 97.03,40.89 97.03,43.43 96.27,44.2 LED3.A 94.98,47.23 97.03,49.28 97.03,51.82 96.27,52.58 95.21,52.58 LED2.A 94.98,54.37 92.2,57.91 v92.2,62.74 | v76.96,62.74 67.31,62.74 64.01,66.04 64.01,78.74 61.72,81.03 61.72,109.73 59.15,112.3 KIT1.VIN JP_LEFT.19 39.34,112.3 37.85,113.28 37.77,115.32 R16_ALM.2 36.83,116.25 36.07,116.33 33.78,118.62 4.57,118.62 1.78,115.82 1.78,66.04 3.76,64.06 IC2.3 10.87,64.06 13.72,61.21 13.72,55.99 C2_9V.+ 13.77,53.8 14.99,52.58 22.86,52.58 24.64,50.8 24.64,35.56 23.88,34.8 23.88,33.02 23.11,32.26 IC1.16 15.39,32.26 C4_MAX.- | 80.26,69.6 76.96,67.06 76.83,62.87 v76.96,62.74 | 77.09,62.61 v76.96,62.74